# Altium schematic sheet mcu.SchDoc
size A4
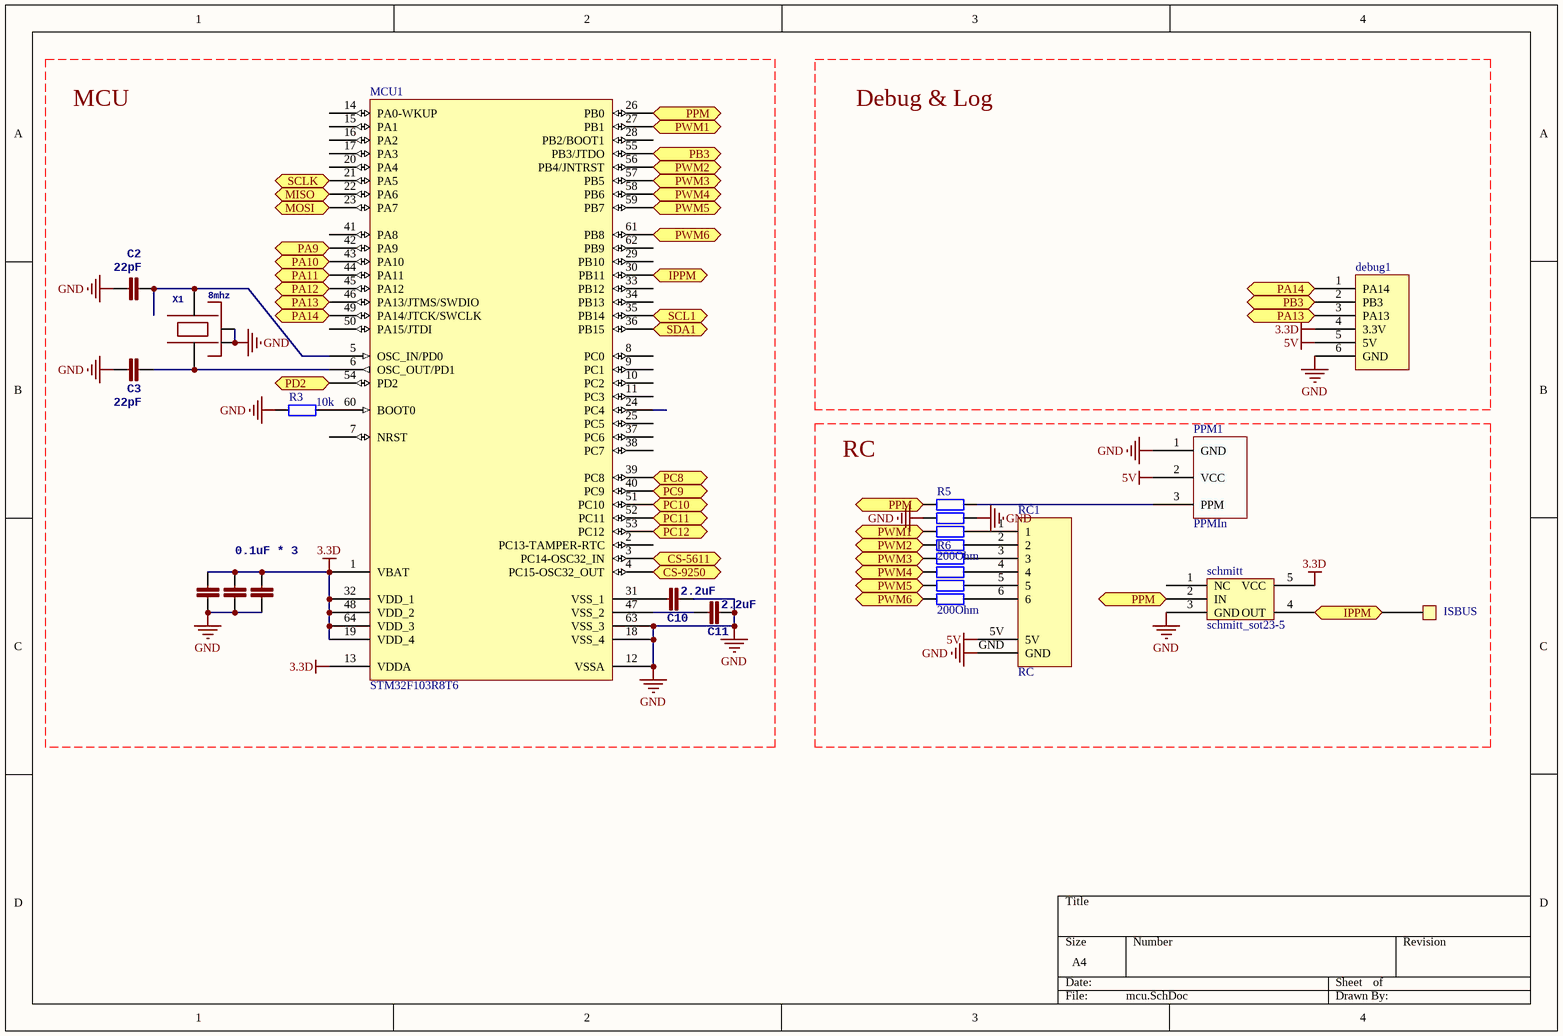
[diagram p0: mcu.SchDoc]

## Parts
C2  22pF  [0402]
C3  22pF  [0402]
C4  0.1uF * 3  [0402]
C5  1n  [0402]  (value not drawn)
C6  1n  [0402]  (value not drawn)
C10  2.2uF  [0603]
C11  2.2uF  [0603]
debug1  debug  [WFRSM125]  (value not drawn)
ISBUS  TestPad  [TestPad]  (value not drawn)
MCU1  STM32F103R8T6  [LQFP64_N]
PPM1  PPMIn  [ServoConnector]
R3  10k  [0402]
R5  value 200Ohm  [0402X4]  (hidden comment: Res*4)
R6  value 200Ohm  [0402X4]  (hidden comment: Res*4)
RC1  RC  [6P]
schmitt  schmitt_sot23-5  [SOT23-5]
X1  8mhz  [OSCILLATOR-3.2X2.5]

## Ports
CS-5611, CS-9250, IPPM, MISO, MOSI, PA9, PA10, PA11, PA12, PA13, PA14, PB3, PC8, PC9, PC10, PC11, PC12, PD2, PPM, PWM1, PWM2, PWM3, PWM4, PWM5, PWM6, SCL1, SCLK, SDA1

## Nets
3.3D: C4.2 C5.2 C6.2 debug1.4(3.3V) MCU1.1(VBAT) MCU1.13(VDDA) MCU1.19(VDD_4) MCU1.32(VDD_1) MCU1.48(VDD_2) MCU1.64(VDD_3) schmitt.5(VCC)
5V: debug1.5(5V) PPM1.2(VCC) RC1.5V
GND: C2.2 C3.2 C4.1 C5.1 C6.1 C10.2 C11.2 debug1.6(GND) MCU1.12(VSSA) MCU1.18(VSS_4) MCU1.63(VSS_3) PPM1.1(GND) R3.1 R5.2 R5.7 RC1.GND schmitt.3(GND) X1.2(NC_2) X1.4(NC_4)
CS-5611: MCU1.3(PC14-OSC32_IN) ; port CS-5611
CS-9250: MCU1.4(PC15-OSC32_OUT) ; port CS-9250
IPPM: ISBUS.1 MCU1.30(PB11) schmitt.4(OUT) ; port IPPM
MISO: MCU1.22(PA6) ; port MISO
MOSI: MCU1.23(PA7) ; port MOSI
PA9: MCU1.42(PA9) ; port PA9
PA10: MCU1.43(PA10) ; port PA10
PA11: MCU1.44(PA11) ; port PA11
PA12: MCU1.45(PA12) ; port PA12
PA13: debug1.3(PA13) MCU1.46(PA13/JTMS/SWDIO) ; port PA13
PA14: debug1.1(PA14) MCU1.49(PA14/JTCK/SWCLK) ; port PA14
PB3: debug1.2(PB3) MCU1.55(PB3/JTDO) ; port PB3
PC8: MCU1.39(PC8) ; port PC8
PC9: MCU1.40(PC9) ; port PC9
PC10: MCU1.51(PC10) ; port PC10
PC11: MCU1.52(PC11) ; port PC11
PC12: MCU1.53(PC12) ; port PC12
PD2: MCU1.54(PD2) ; port PD2
PPM: MCU1.26(PB0) R5.8 schmitt.2(IN) ; port PPM
PWM1: MCU1.27(PB1) R5.6 ; port PWM1
PWM2: MCU1.56(PB4/JNTRST) R5.5 ; port PWM2
PWM3: MCU1.57(PB5) R6.8 ; port PWM3
PWM4: MCU1.58(PB6) R6.7 ; port PWM4
PWM5: MCU1.59(PB7) R6.6 ; port PWM5
PWM6: MCU1.61(PB8) R6.5 ; port PWM6
SCL1: MCU1.35(PB14) ; port SCL1
SCLK: MCU1.21(PA5) ; port SCLK
SDA1: MCU1.36(PB15) ; port SDA1
NetC2_1: C2.1 MCU1.5(OSC_IN/PD0) X1.3
NetC3_1: C3.1 MCU1.6(OSC_OUT/PD1) X1.1
NetC10_1: C10.1 MCU1.31(VSS_1)
NetC11_1: C11.1 MCU1.47(VSS_2)
NetMCU1_60: MCU1.60(BOOT0) R3.2
NetPPM1_3: PPM1.3(PPM) R5.1
NetR5_3: R5.3 RC1.1
NetR5_4: R5.4 RC1.2
NetR6_1: R6.1 RC1.3
NetR6_2: R6.2 RC1.4
NetR6_3: R6.3 RC1.5
NetR6_4: R6.4 RC1.6

Not connected (* = marked no-connect by the designer): MCU1 2(PC13-TAMPER-RTC) 7(NRST) 8(PC0) 9(PC1) 10(PC2) 11(PC3) 14(PA0-WKUP) 15(PA1) 16(PA2) 17(PA3) 20(PA4) 24(PC4) 25(PC5) 28(PB2/BOOT1) 29(PB10) 33(PB12) 34(PB13) 37(PC6) 38(PC7) 41(PA8) 50(PA15/JTDI) 62(PB9); schmitt 1(NC)

## Notes on the sheet
- MCU
- Debug & Log
- RC

## Library data of the parts
C2-C6 C10 C11 = CAP0402-CAP: <b>Capacitor</b> / Standard 0603 ceramic capacitor, and 0.1" leaded capacitor.; PARTNO: CC0402ZRY5V7BB104
MCU1 = STM32F103R8T6: STM32 ARM-based 32-bit MCU with 64 Kbytes Flash, 64-pin LQFP, Industrial Temperature; Published: *; DatasheetVersion: *; PackageVersion: *; PackageReference: *; Publisher: *; PackageDescription: *; ComponentLink1Description: *; ComponentLink1URL: *; ComponentLink2Description: *; ComponentLink2URL: *
R3 = Res2: Resistor; Value: 0Ohm; Published: 8-Jun-2000; LatestRevisionDate: 17-Jul-2002; LatestRevisionNote: Re-released for DXP Platform.; PackageReference: AXIAL-0.4; Publisher: Altium Limited; PackageDescription: Axial Device, Thru-Hole; 2 Leads; 0.4 in Pin Spacing
R5 R6 = Res*4: Resistor; Published: 8-Jun-2000; LatestRevisionDate: 17-Jul-2002; LatestRevisionNote: Re-released for DXP Platform.; PackageReference: AXIAL-0.4; Publisher: Altium Limited; PackageDescription: Axial Device, Thru-Hole; 2 Leads; 0.4 in Pin Spacing
X1 = OSCILLATOR-3.2X2.5: Crystal Oscillator in 3.2x2.5 SMD